# EAGLE design flex_v1 (EAGLE 7.2.0)
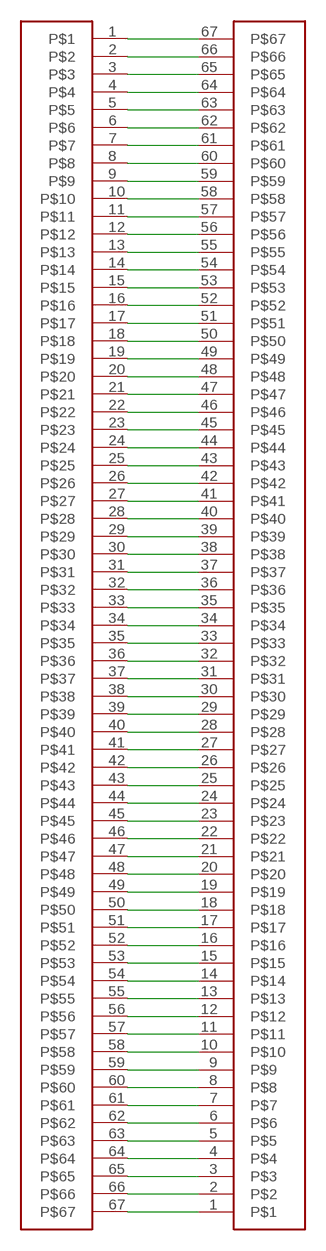
[diagram p0: schematic, sheet 1]

## Parts
U$1  CONN_FFC_67WAY  [CONN_67WAY_FFC_LCD]
U$2  CONN_FFC_67WAY_PCB  [CONN_67WAY_FFC_PCB]

## Nets
N$1: U$1.67 U$2.1
N$2: U$1.66 U$2.2
N$3: U$1.65 U$2.3
N$4: U$1.64 U$2.4
N$5: U$1.63 U$2.5
N$6: U$1.62 U$2.6
N$7: U$1.61 U$2.7
N$8: U$1.60 U$2.8
N$9: U$1.59 U$2.9
N$10: U$1.58 U$2.10
N$11: U$1.57 U$2.11
N$12: U$1.56 U$2.12
N$13: U$1.55 U$2.13
N$14: U$1.54 U$2.14
N$15: U$1.53 U$2.15
N$16: U$1.52 U$2.16
N$17: U$1.51 U$2.17
N$18: U$1.50 U$2.18
N$19: U$1.49 U$2.19
N$20: U$1.48 U$2.20
N$21: U$1.47 U$2.21
N$22: U$1.46 U$2.22
N$23: U$1.45 U$2.23
N$24: U$1.44 U$2.24
N$25: U$1.43 U$2.25
N$26: U$1.42 U$2.26
N$27: U$1.41 U$2.27
N$28: U$1.40 U$2.28
N$29: U$1.39 U$2.29
N$30: U$1.38 U$2.30
N$31: U$1.37 U$2.31
N$32: U$1.36 U$2.32
N$33: U$1.35 U$2.33
N$34: U$1.34 U$2.34
N$35: U$1.33 U$2.35
N$36: U$1.32 U$2.36
N$37: U$1.31 U$2.37
N$38: U$1.30 U$2.38
N$39: U$1.29 U$2.39
N$40: U$1.28 U$2.40
N$41: U$1.27 U$2.41
N$42: U$1.26 U$2.42
N$43: U$1.25 U$2.43
N$44: U$1.24 U$2.44
N$45: U$1.23 U$2.45
N$46: U$1.22 U$2.46
N$47: U$1.21 U$2.47
N$48: U$1.20 U$2.48
N$49: U$1.19 U$2.49
N$50: U$1.18 U$2.50
N$51: U$1.17 U$2.51
N$52: U$1.16 U$2.52
N$53: U$1.15 U$2.53
N$54: U$1.14 U$2.54
N$55: U$1.13 U$2.55
N$56: U$1.12 U$2.56
N$57: U$1.11 U$2.57
N$58: U$1.10 U$2.58
N$59: U$1.9 U$2.59
N$60: U$1.8 U$2.60
N$61: U$1.7 U$2.61
N$62: U$1.6 U$2.62
N$63: U$1.5 U$2.63
N$64: U$1.4 U$2.64
N$65: U$1.3 U$2.65
N$66: U$1.2 U$2.66
N$67: U$1.1 U$2.67

## Library data of the parts
U$1 = m0wut:CONN_FFC_67WAY
U$2 = m0wut:CONN_FFC_67WAY_PCB

## Board
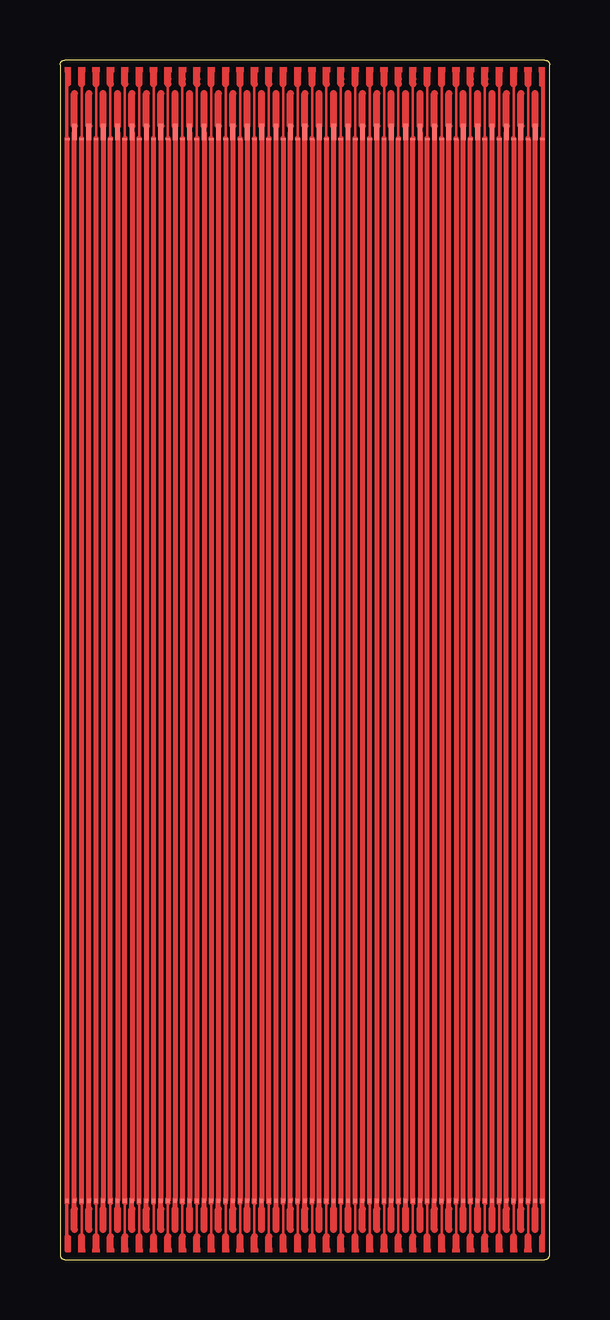
[diagram p1: board, top side]

Size 20.4 x 50 mm. Coordinates in mm from the lower left corner, seen from the top.
Outline: 0.2,0 20.2,0 arc90 20.4,0.2 20.4,49.8 arc90 20.2,50 0.2,50 arc90 0,49.8 0,0.2 arc90 0.2,0
Copper layers (1*16): Top 0.035mm / dielectric 1.5mm / Bottom 0.035mm
Design rules "dirty pcbs": minimum track width 5mil, minimum drill 12mil, track to track 5mil, track to pad 5mil, pad to pad 5mil, via to via 5mil, smd to smd 0mil, copper to edge 10mil, drill to drill 10mil, minimum pad ring 10mil, minimum via ring 6mil, stop-mask expansion 2mil, vias tented up to drill 25mil, thermal gap 10mil

### Footprints (pad centres in the part's own frame; a part is rotated, then mirrored left to right if it is on the bottom)
CONN_67WAY_FFC_LCD = smd 0.2 x 0.1: 1 -9.9,-3.3; 3 -9.3,-3.3; 5 -8.7,-3.3; 7 -8.1,-3.3; 9 -7.5,-3.3; 11 -6.9,-3.3; 13 -6.3,-3.3; 15 -5.7,-3.3; 17 -5.1,-3.3; 19 -4.5,-3.3; 21 -3.9,-3.3; 23 -3.3,-3.3; 25 -2.7,-3.3; 27 -2.1,-3.3; 29 -1.5,-3.3; 31 -0.9,-3.3; 33 -0.3,-3.3; 35 0.3,-3.3; 37 0.9,-3.3; 39 1.5,-3.3; 41 2.1,-3.3; 43 2.7,-3.3; 45 3.3,-3.3; 47 3.9,-3.3; 49 4.5,-3.3; 51 5.1,-3.3; 53 5.7,-3.3; 55 6.3,-3.3; 57 6.9,-3.3; 59 7.5,-3.3; 61 8.1,-3.3; 63 8.7,-3.3; 65 9.3,-3.3; 67 9.9,-3.3 | smd 0.2 x 0.7: 2 -9.6,-3; 4 -9,-3; 6 -8.4,-3; 8 -7.8,-3; 10 -7.2,-3; 12 -6.6,-3; 14 -6,-3; 16 -5.4,-3; 18 -4.8,-3; 20 -4.2,-3; 22 -3.6,-3; 24 -3,-3; 26 -2.4,-3; 28 -1.8,-3; 30 -1.2,-3; 32 -0.6,-3; 34 0,-3; 36 0.6,-3; 38 1.2,-3; 40 1.8,-3; 42 2.4,-3; 44 3,-3; 46 3.6,-3; 48 4.2,-3; 50 4.8,-3; 52 5.4,-3; 54 6,-3; 56 6.6,-3; 58 7.2,-3; 60 7.8,-3; 62 8.4,-3; 64 9,-3; 66 9.6,-3
CONN_67WAY_FFC_PCB = smd 0.15 x 0.15: 1 -9.9,-2.45; 2 -9.6,-2.45; 3 -9.3,-2.45; 4 -9,-2.45; 5 -8.7,-2.45; 6 -8.4,-2.45; 7 -8.1,-2.45; 8 -7.8,-2.45; 9 -7.5,-2.45; 10 -7.2,-2.45; 11 -6.9,-2.45; 12 -6.6,-2.45; 13 -6.3,-2.45; 14 -6,-2.45; 15 -5.7,-2.45; 16 -5.4,-2.45; 17 -5.1,-2.45; 18 -4.8,-2.45; 19 -4.5,-2.45; 20 -4.2,-2.45; 21 -3.9,-2.45; 22 -3.6,-2.45; 23 -3.3,-2.45; 24 -3,-2.45; 25 -2.7,-2.45; 26 -2.4,-2.45; 27 -2.1,-2.45; 28 -1.8,-2.45; 29 -1.5,-2.45; 30 -1.2,-2.45; 31 -0.9,-2.45; 32 -0.6,-2.45; 33 -0.3,-2.45; 34 0,-2.45; 35 0.3,-2.45; 36 0.6,-2.45; 37 0.9,-2.45; 38 1.2,-2.45; 39 1.5,-2.45; 40 1.8,-2.45; 41 2.1,-2.45; 42 2.4,-2.45; 43 2.7,-2.45; 44 3,-2.45; 45 3.3,-2.45; 46 3.6,-2.45; 47 3.9,-2.45; 48 4.2,-2.45; 49 4.5,-2.45; 50 4.8,-2.45; 51 5.1,-2.45; 52 5.4,-2.45; 53 5.7,-2.45; 54 6,-2.45; 55 6.3,-2.45; 56 6.6,-2.45; 57 6.9,-2.45; 58 7.2,-2.45; 59 7.5,-2.45; 60 7.8,-2.45; 61 8.1,-2.45; 62 8.4,-2.45; 63 8.7,-2.45; 64 9,-2.45; 65 9.3,-2.45; 66 9.6,-2.45; 67 9.9,-2.45

### Placement (x,y rotation side)
U$1  10.2,50 0 top
U$2  10.2,0 180 top

### Tracks (layer width: path | path; a pad name or v marks a point on that pad's centre or on a via)
N$1
  Top 0.2: U$1.67 U$2.1
N$2
  Top 0.2: U$2.2 U$1.66
N$3
  Top 0.2: U$1.65 U$2.3
N$4
  Top 0.2: U$2.4 U$1.64
N$5
  Top 0.2: U$1.63 U$2.5
N$6
  Top 0.2: U$2.6 U$1.62
N$7
  Top 0.2: U$1.61 U$2.7
N$8
  Top 0.2: U$2.8 U$1.60
N$9
  Top 0.2: U$1.59 U$2.9
N$10
  Top 0.2: U$1.58 U$2.10
N$11
  Top 0.2: U$2.11 U$1.57
N$12
  Top 0.2: U$2.12 U$1.56
N$13
  Top 0.2: U$1.55 U$2.13
N$14
  Top 0.2: U$2.14 U$1.54
N$15
  Top 0.2: U$1.53 U$2.15
N$16
  Top 0.2: U$1.52 U$2.16
N$17
  Top 0.2: U$2.17 U$1.51
N$18
  Top 0.2: U$1.50 U$2.18
N$19
  Top 0.2: U$2.19 U$1.49
N$20
  Top 0.2: U$1.48 U$2.20
N$21
  Top 0.2: U$2.21 U$1.47
N$22
  Top 0.2: U$1.46 U$2.22
N$23
  Top 0.2: U$2.23 U$1.45
N$24
  Top 0.2: U$1.44 U$2.24
N$25
  Top 0.2: U$2.25 U$1.43
N$26
  Top 0.2: U$1.42 U$2.26
N$27
  Top 0.2: U$2.27 U$1.41
N$28
  Top 0.2: U$2.28 U$1.40
N$29
  Top 0.2: U$1.39 U$2.29
N$30
  Top 0.2: U$2.30 U$1.38
N$31
  Top 0.2: U$1.37 U$2.31
N$32
  Top 0.2: U$2.32 U$1.36
N$33
  Top 0.2: U$1.35 U$2.33
N$34
  Top 0.2: U$2.34 U$1.34
N$35
  Top 0.2: U$1.33 U$2.35
N$36
  Top 0.2: U$2.36 U$1.32
N$37
  Top 0.2: U$1.31 U$2.37
N$38
  Top 0.2: U$2.38 U$1.30
N$39
  Top 0.2: U$2.39 U$1.29
N$40
  Top 0.2: U$1.28 U$2.40
N$41
  Top 0.2: U$1.27 U$2.41
N$42
  Top 0.2: U$1.26 U$2.42
N$43
  Top 0.2: U$1.25 U$2.43
N$44
  Top 0.2: U$1.24 U$2.44
N$45
  Top 0.2: U$1.23 U$2.45
N$46
  Top 0.2: U$1.22 U$2.46
N$47
  Top 0.2: U$1.21 U$2.47
N$48
  Top 0.2: U$1.20 U$2.48
N$49
  Top 0.2: U$1.19 U$2.49
N$50
  Top 0.2: U$1.18 U$2.50
N$51
  Top 0.2: U$1.17 U$2.51
N$52
  Top 0.2: U$1.16 U$2.52
N$53
  Top 0.2: U$1.15 U$2.53
N$54
  Top 0.2: U$1.14 U$2.54
N$55
  Top 0.2: U$2.55 U$1.13
N$56
  Top 0.2: U$1.12 U$2.56
N$57
  Top 0.2: U$2.57 U$1.11
N$58
  Top 0.2: U$1.10 U$2.58
N$59
  Top 0.2: U$2.59 U$1.9
N$60
  Top 0.2: U$1.8 U$2.60
N$61
  Top 0.2: U$2.61 U$1.7
N$62
  Top 0.2: U$1.6 U$2.62
N$63
  Top 0.2: U$2.63 U$1.5
N$64
  Top 0.2: U$2.64 U$1.4
N$65
  Top 0.2: U$2.65 U$1.3
N$66
  Top 0.2: U$2.66 U$1.2
N$67
  Top 0.2: U$2.67 U$1.1

### Text on the board
tDocu: HDP | LCD